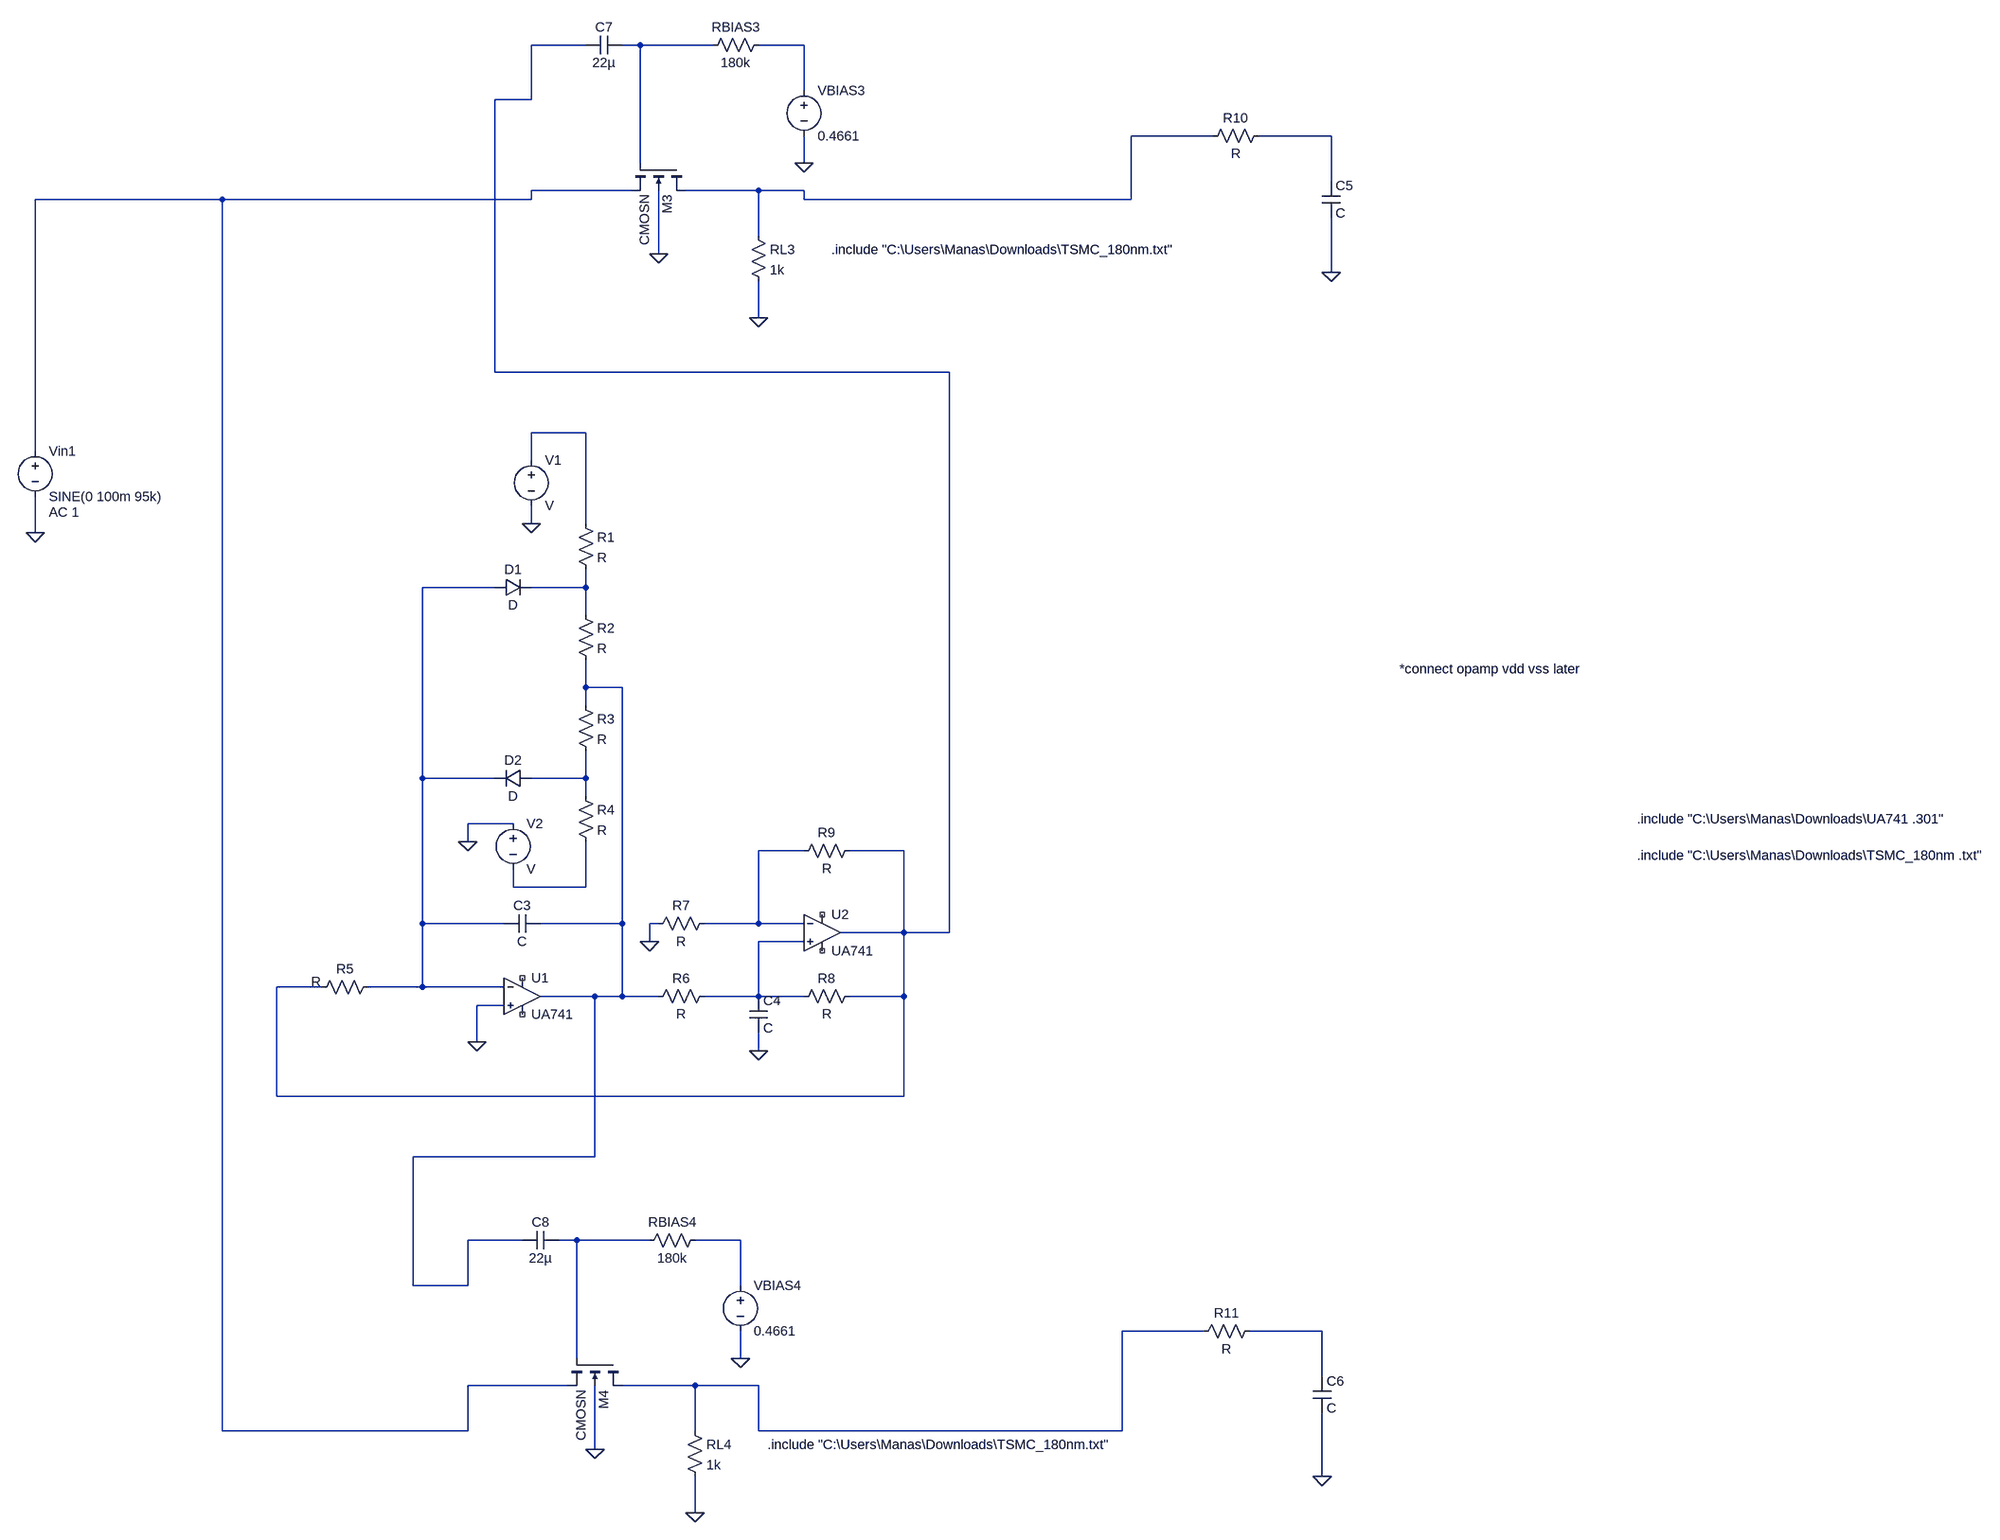
[diagram p0: schematic complete circuit.asc]
complete circuit.asc, the LTspice schematic file:
Version 4
SHEET 1 3908 2452
WIRE 288 -256 192 -256
WIRE 384 -256 352 -256
WIRE 512 -256 384 -256
WIRE 672 -256 592 -256
WIRE 672 -176 672 -256
WIRE 192 -160 192 -256
WIRE 192 -160 128 -160
WIRE 1392 -96 1248 -96
WIRE 1600 -96 1472 -96
WIRE 384 -48 384 -256
WIRE 672 -48 672 -96
WIRE 1600 -16 1600 -96
WIRE 368 0 192 0
WIRE 592 0 464 0
WIRE 672 0 592 0
WIRE -352 16 -688 16
WIRE 192 16 192 0
WIRE 192 16 -352 16
WIRE 672 16 672 0
WIRE 1248 16 1248 -96
WIRE 1248 16 672 16
WIRE 592 80 592 0
WIRE 416 112 416 0
WIRE 1600 144 1600 48
WIRE 592 224 592 160
WIRE 128 320 128 -160
WIRE 928 320 128 320
WIRE 288 432 192 432
WIRE -688 464 -688 16
WIRE 192 480 192 432
WIRE 192 592 192 560
WIRE 288 592 288 432
WIRE -688 608 -688 544
WIRE 128 704 0 704
WIRE 288 704 288 672
WIRE 288 704 192 704
WIRE 288 752 288 704
WIRE 288 880 288 832
WIRE 352 880 288 880
WIRE 288 912 288 880
WIRE 0 1040 0 704
WIRE 128 1040 0 1040
WIRE 288 1040 288 992
WIRE 288 1040 192 1040
WIRE 288 1072 288 1040
WIRE 160 1120 80 1120
WIRE 80 1152 80 1120
WIRE 672 1168 592 1168
WIRE 848 1168 752 1168
WIRE 160 1232 160 1200
WIRE 288 1232 288 1152
WIRE 288 1232 160 1232
WIRE 0 1296 0 1040
WIRE 144 1296 0 1296
WIRE 352 1296 352 880
WIRE 352 1296 208 1296
WIRE 416 1296 400 1296
WIRE 592 1296 592 1168
WIRE 592 1296 496 1296
WIRE 672 1296 592 1296
WIRE 848 1312 848 1168
WIRE 848 1312 736 1312
WIRE 928 1312 928 320
WIRE 928 1312 848 1312
WIRE 400 1328 400 1296
WIRE 672 1328 592 1328
WIRE -176 1408 -256 1408
WIRE 0 1408 0 1296
WIRE 0 1408 -96 1408
WIRE 144 1408 0 1408
WIRE 304 1424 208 1424
WIRE 352 1424 352 1296
WIRE 352 1424 304 1424
WIRE 416 1424 352 1424
WIRE 592 1424 592 1328
WIRE 592 1424 496 1424
WIRE 672 1424 592 1424
WIRE 848 1424 848 1312
WIRE 848 1424 752 1424
WIRE 144 1440 96 1440
WIRE 96 1504 96 1440
WIRE 592 1520 592 1488
WIRE -256 1600 -256 1408
WIRE 848 1600 848 1424
WIRE 848 1600 -256 1600
WIRE 304 1712 304 1424
WIRE 304 1712 -16 1712
WIRE 176 1872 80 1872
WIRE 272 1872 240 1872
WIRE 400 1872 272 1872
WIRE 560 1872 480 1872
WIRE -16 1952 -16 1712
WIRE 80 1952 80 1872
WIRE 80 1952 -16 1952
WIRE 560 1952 560 1872
WIRE 1376 2032 1232 2032
WIRE 1584 2032 1456 2032
WIRE 272 2080 272 1872
WIRE 560 2080 560 2032
WIRE 1584 2112 1584 2032
WIRE 256 2128 80 2128
WIRE 480 2128 352 2128
WIRE 592 2128 480 2128
WIRE -352 2208 -352 16
WIRE 80 2208 80 2128
WIRE 80 2208 -352 2208
WIRE 480 2208 480 2128
WIRE 592 2208 592 2128
WIRE 1232 2208 1232 2032
WIRE 1232 2208 592 2208
WIRE 304 2240 304 2128
WIRE 1584 2288 1584 2176
WIRE 480 2352 480 2288
FLAG 96 1504 0
FLAG 592 1520 0
FLAG 400 1328 0
FLAG 192 592 0
FLAG 80 1152 0
FLAG 1600 144 0
FLAG 1584 2288 0
FLAG 416 112 0
FLAG 592 224 0
FLAG 672 -48 0
FLAG 304 2240 0
FLAG 480 2352 0
FLAG 560 2080 0
FLAG -688 608 0
SYMBOL res 272 576 R0
SYMATTR InstName R1
SYMBOL res 272 736 R0
SYMATTR InstName R2
SYMBOL res 272 896 R0
SYMATTR InstName R3
SYMBOL res 272 1056 R0
SYMATTR InstName R4
SYMBOL cap 208 1280 R90
WINDOW 0 0 32 VBottom 2
WINDOW 3 32 32 VTop 2
SYMATTR InstName C3
SYMBOL res -80 1392 R90
WINDOW 0 0 56 VBottom 2
WINDOW 3 -9 107 VTop 2
SYMATTR InstName R5
SYMBOL OpAmps\\opamp2 176 1360 R0
SYMATTR InstName U1
SYMATTR Value UA741
SYMBOL OpAmps\\opamp2 704 1248 R0
SYMATTR InstName U2
SYMATTR Value UA741
SYMBOL res 512 1408 R90
WINDOW 0 0 56 VBottom 2
WINDOW 3 32 56 VTop 2
SYMATTR InstName R6
SYMBOL res 512 1280 R90
WINDOW 0 0 56 VBottom 2
WINDOW 3 32 56 VTop 2
SYMATTR InstName R7
SYMBOL cap 576 1424 R0
SYMATTR InstName C4
SYMBOL res 768 1408 R90
WINDOW 0 0 56 VBottom 2
WINDOW 3 32 56 VTop 2
SYMATTR InstName R8
SYMBOL res 768 1152 R90
WINDOW 0 0 56 VBottom 2
WINDOW 3 32 56 VTop 2
SYMATTR InstName R9
SYMBOL voltage 192 464 R0
SYMATTR InstName V1
SYMBOL voltage 160 1104 R0
SYMATTR InstName V2
SYMBOL diode 128 720 R270
WINDOW 0 32 32 VTop 2
WINDOW 3 0 32 VBottom 2
SYMATTR InstName D1
SYMBOL diode 192 1024 R90
WINDOW 0 0 32 VBottom 2
WINDOW 3 32 32 VTop 2
SYMATTR InstName D2
SYMBOL res 1488 -112 R90
WINDOW 0 0 56 VBottom 2
WINDOW 3 32 56 VTop 2
SYMATTR InstName R10
SYMBOL cap 1584 -16 R0
SYMATTR InstName C5
SYMBOL res 1472 2016 R90
WINDOW 0 0 56 VBottom 2
WINDOW 3 32 56 VTop 2
SYMATTR InstName R11
SYMBOL cap 1568 2112 R0
SYMATTR InstName C6
SYMBOL voltage 672 -192 R0
WINDOW 123 0 0 Left 0
WINDOW 39 0 0 Left 0
SYMATTR InstName VBIAS3
SYMATTR Value 0.4661
SYMBOL res 576 64 R0
SYMATTR InstName RL3
SYMATTR Value 1k
SYMBOL res 608 -272 R90
WINDOW 0 0 56 VBottom 2
WINDOW 3 32 56 VTop 2
SYMATTR InstName RBIAS3
SYMATTR Value 180k
SYMBOL cap 352 -272 R90
WINDOW 0 0 32 VBottom 2
WINDOW 3 32 32 VTop 2
SYMATTR InstName C7
SYMATTR Value 22µ
SYMBOL nmos4 464 -48 R90
SYMATTR InstName M3
SYMATTR Value CMOSN
SYMATTR Value2 l=0.18u w=1.8u ad={5 * 1.8u * 0.09u} as={5 * 1.8u * 0.09u} pd={10 * 0.09u +2 *1.8u} ps={10 *0.09u + 2 * 1.8u}
SYMBOL voltage 560 1936 R0
WINDOW 123 0 0 Left 0
WINDOW 39 0 0 Left 0
SYMATTR InstName VBIAS4
SYMATTR Value 0.4661
SYMBOL res 464 2192 R0
SYMATTR InstName RL4
SYMATTR Value 1k
SYMBOL res 496 1856 R90
WINDOW 0 0 56 VBottom 2
WINDOW 3 32 56 VTop 2
SYMATTR InstName RBIAS4
SYMATTR Value 180k
SYMBOL cap 240 1856 R90
WINDOW 0 0 32 VBottom 2
WINDOW 3 32 32 VTop 2
SYMATTR InstName C8
SYMATTR Value 22µ
SYMBOL nmos4 352 2080 R90
SYMATTR InstName M4
SYMATTR Value CMOSN
SYMATTR Value2 l=0.18u w=1.8u ad={5 * 1.8u * 0.09u} as={5 * 1.8u * 0.09u} pd={10 * 0.09u +2 *1.8u} ps={10 *0.09u + 2 * 1.8u}
SYMBOL voltage -688 448 R0
WINDOW 123 24 124 Left 2
WINDOW 39 0 0 Left 0
SYMATTR Value2 AC 1
SYMATTR InstName Vin1
SYMATTR Value SINE(0 100m 95k)
TEXT 3232 1176 Left 2 !.include "C:\\Users\\Manas\\Downloads\\TSMC_180nm .txt"
TEXT 3232 1112 Left 2 !.include "C:\\Users\\Manas\\Downloads\\UA741 .301"
TEXT 1720 848 Left 2 !*connect opamp vdd vss later
TEXT 720 104 Left 2 !.include "C:\\Users\\Manas\\Downloads\\TSMC_180nm.txt"
TEXT 608 2232 Left 2 !.include "C:\\Users\\Manas\\Downloads\\TSMC_180nm.txt"

The netlist it stands for:
* complete circuit.asc
R1 N007 N009 R
R2 N009 N010 R
R3 N010 N011 R
R4 N011 N013 R
C3 N010 N008 C
R5 N008 N001 R
XU1 0 N008 NC_01 NC_02 N010 UA741  ; pins In+ In- V+ V- OUT
XU2 N014 N012 NC_03 NC_04 N001 UA741  ; pins In+ In- V+ V- OUT
R6 N014 N010 R
R7 N012 0 R
C4 N014 0 C
R8 N001 N014 R
R9 N001 N012 R
V1 N007 0 V
V2 0 N013 V
D1 N008 N009 D
D2 N011 N008 D
R10 N005 N004 R
C5 N005 0 C
R11 N018 N017 R
C6 N018 0 C
VBIAS3 N003 0 0.4661
RL3 N004 0 1k
RBIAS3 N003 N002 180k
C7 N002 N001 22µ
M3 N004 N002 N006 0 CMOSN l=0.18u w=1.8u ad={5 * 1.8u * 0.09u} as={5 * 1.8u * 0.09u} pd={10 * 0.09u +2 *1.8u} ps={10 *0.09u + 2 * 1.8u}
VBIAS4 N016 0 0.4661
RL4 N017 0 1k
RBIAS4 N016 N015 180k
C8 N015 N010 22µ
M4 N017 N015 N006 0 CMOSN l=0.18u w=1.8u ad={5 * 1.8u * 0.09u} as={5 * 1.8u * 0.09u} pd={10 * 0.09u +2 *1.8u} ps={10 *0.09u + 2 * 1.8u}
Vin1 N006 0 SINE(0 100m 95k) AC 1
.model D D
.lib standard.dio
.model NMOS NMOS
.model PMOS PMOS
.lib standard.mos
.include "C:\Users\Manas\Downloads\TSMC_180nm .txt"
.include "C:\Users\Manas\Downloads\UA741 .301"
*connect opamp vdd vss later
.include "C:\Users\Manas\Downloads\TSMC_180nm.txt"
.include "C:\Users\Manas\Downloads\TSMC_180nm.txt"
.backanno
.end